# Altium schematic sheet WEMOS D1 MINI_2021-04-02.schdoc
size 57 x 45 mm
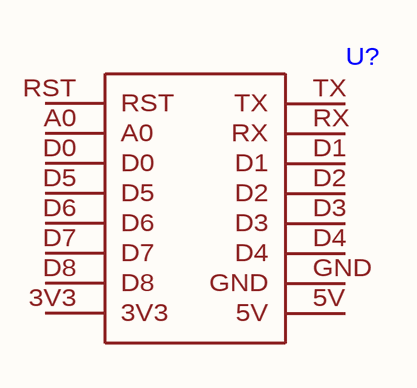
[diagram p0: WEMOS D1 MINI_2021-04-02.schdoc]

## Parts
U?  (no value)  [WEMOS D1 MINI]

## Nets

Not connected (* = marked no-connect by the designer): U? 3V3 5V A0 D0 D1 D2 D3 D4 D5 D6 D7 D8 GND RST RX TX

## Library data of the parts
U? = WEMOS D1 MINI